# Altium schematic sheet ADC Chip And ISO.SchDoc
size A4; SheetNumber: 4; SheetTotal: 5
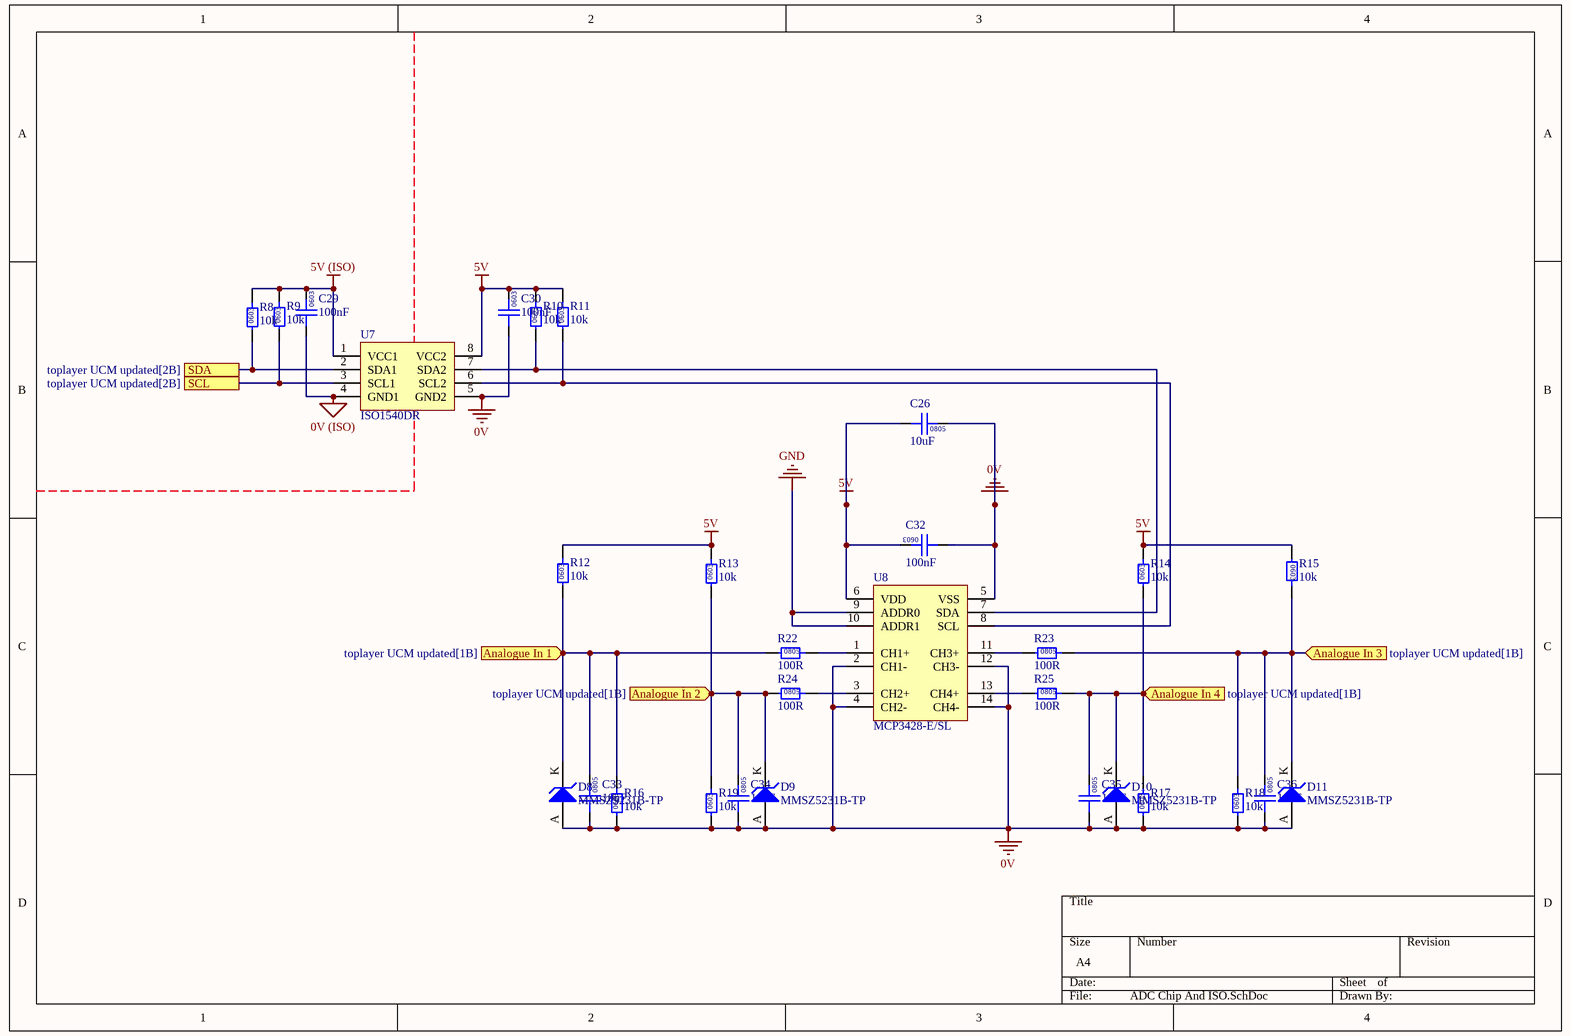
[diagram p0: ADC Chip And ISO.SchDoc]

## Parts
C26  10uF  [0805]
C29  100nF  [0603]
C30  100nF  [0603]
C32  100nF  [0603]
C33  10uF  [0805]
C34  10uF  [0805]
C35  10uF  [0805]
C36  10uF  [0805]
D8  MMSZ5231B-TP  [SOD-123 Diode]
D9  MMSZ5231B-TP  [SOD-123 Diode]
D10  MMSZ5231B-TP  [SOD-123 Diode]
D11  MMSZ5231B-TP  [SOD-123 Diode]
R8  10k  [0603]
R9  10k  [0603]
R10  10k  [0603]
R11  10k  [0603]
R12  10k  [0603]
R13  10k  [0603]
R14  10k  [VB 0207]
R15  10k  [VB 0207]
R16  10k  [0603]
R17  10k  [0603]
R18  10k  [0603]
R19  10k  [0603]
R22  100R  [0805]
R23  100R  [0805]
R24  100R  [0805]
R25  100R  [0805]
U7  ISO1540DR  [TI 8-SOIC]
U8  MCP3428-E/SL  [MC 14-SOIC]

## Ports
Analogue In 1 (in, see toplayer UCM updated[1B]), Analogue In 2 (in, see toplayer UCM updated[1B]), Analogue In 3 (in, see toplayer UCM updated[1B]), Analogue In 4 (in, see toplayer UCM updated[1B]), SCL (see toplayer UCM updated[2B]), SDA (see toplayer UCM updated[2B])

## Nets
0V: C26.2 C30.1 C32.1 C33.1 C34.1 C35.1 C36.1 D8.A D9.A D10.A D11.A R16.1 R17.1 R18.1 R19.1 U7.5(GND2) U8.2(CH1-) U8.4(CH2-) U8.5(VSS) U8.12(CH3-) U8.14(CH4-)
0V (ISO): C29.1 U7.4(GND1)
5V: C26.1 C30.2 C32.2 R10.2 R11.2 R12.2 R13.2 R14.2 R15.1 U7.8(VCC2) U8.6(VDD)
5V (ISO): C29.2 R8.2 R9.2 U7.1(VCC1)
GND: U8.9(ADDR0) U8.10(ADDR1)
Analogue In 1: C33.2 D8.K R12.1 R16.2 R22.1 ; port Analogue In 1
Analogue In 2: C34.2 D9.K R13.1 R19.2 R24.1 ; port Analogue In 2
Analogue In 3: C36.2 D11.K R15.2 R18.2 R23.2 ; port Analogue In 3
Analogue In 4: C35.2 D10.K R14.1 R17.2 R25.2 ; port Analogue In 4
SCL: R9.1 U7.3(SCL1) ; port SCL
SDA: R8.1 U7.2(SDA1) ; port SDA
NetR10_1: R10.1 U7.7(SDA2) U8.7(SDA)
NetR11_1: R11.1 U7.6(SCL2) U8.8(SCL)
NetR22_2: R22.2 U8.1(CH1+)
NetR23_1: R23.1 U8.11(CH3+)
NetR24_2: R24.2 U8.3(CH2+)
NetR25_1: R25.1 U8.13(CH4+)

## Notes on the sheet
- (in symbol GCM188L81H104KA57D) 0603
- (in symbol GRM21BR6YA106KE43L) 0805
- (in symbol RC0603FR-0710KL) 0603
- (in symbol RC0805FR07100RL) 0805

## Library data of the parts
C26 C33-C36 = GRM21BR6YA106KE43L: Manufacturer: muRata; Rated Voltage: 50V; Tolerance: 10%; Material: MLCC; Temperature Rating: X5R; Part Number: GRM21BR6YA106KE43L; Value: 10uF; Digikey Part Number: 490-10514-6-ND
C29 C30 C32 = GCM188L81H104KA57D: Manufacturer: muRata; Rated Voltage: 50V; Tolerance: ±10%; Material: MLCC; Temperature Rating: X8L; Part Number: GCM188L81H104KA57D; Value: 100nF; Digikey Part Number: 490-6049-1-ND
D8-D11 = MMSZ5231B-TP: Zener Diode 5.1V 500mW ±5% Surface Mount SOD-123; Manufacturer: On Semiconductor; Part Number: MMSZ5231B-TP; Digikey Part Number: MMSZ5231B-TPMSCT-ND; Digikey Link: https://www.digikey.com/product-detail/en/micro-commercial-co/MMSZ5231B-TP/MMSZ5231B-TPMSCT-ND/1793361
R8-R19 = RC0603FR-0710KL: Manufacturer: YAGEO; Tolerance: 0.01; Rated Power: 0.1W; Part Number: RC0603FR-0710KL; Value: 10k; Material: FR-07; Digikey Part Number: 311-10.0KHRCT-ND
R22-R25 = RC0805FR07100RL: Manufacturer: YAGEO; Tolerance: 0.01; Rated Power: 0.125W; Part Number: RC0805FR07100RL; Value: 100R; Material: FR-07; Digikey Part Number: 311-100CRCT-ND
U7 = ISO1540DR: I2C Digital Isolator (Multichannel); Manufacturer: Texas Instruments; Part Number: ISO1540DR; Digikey Part Number: 296-34871-1-ND; Digikey Link: https://www.digikey.com/product-detail/en/texas-instruments/ISO1540DR/296-34871-1-ND/3587214
U8 = MCP3428-E/SL: 4 Channel I2C ADC, 16 bit; Manufacturer: Microchip Technology; Part Number: MCP3428-E/SL; Digikey Part Number: MCP3428-E/SL-ND; Digikey Link: https://www.digikey.com/product-detail/en/microchip-technology/MCP3428-E-SL/MCP3428-E-SL-ND/2179226